# Altium schematic sheet OPA4377.SchDoc
size A4
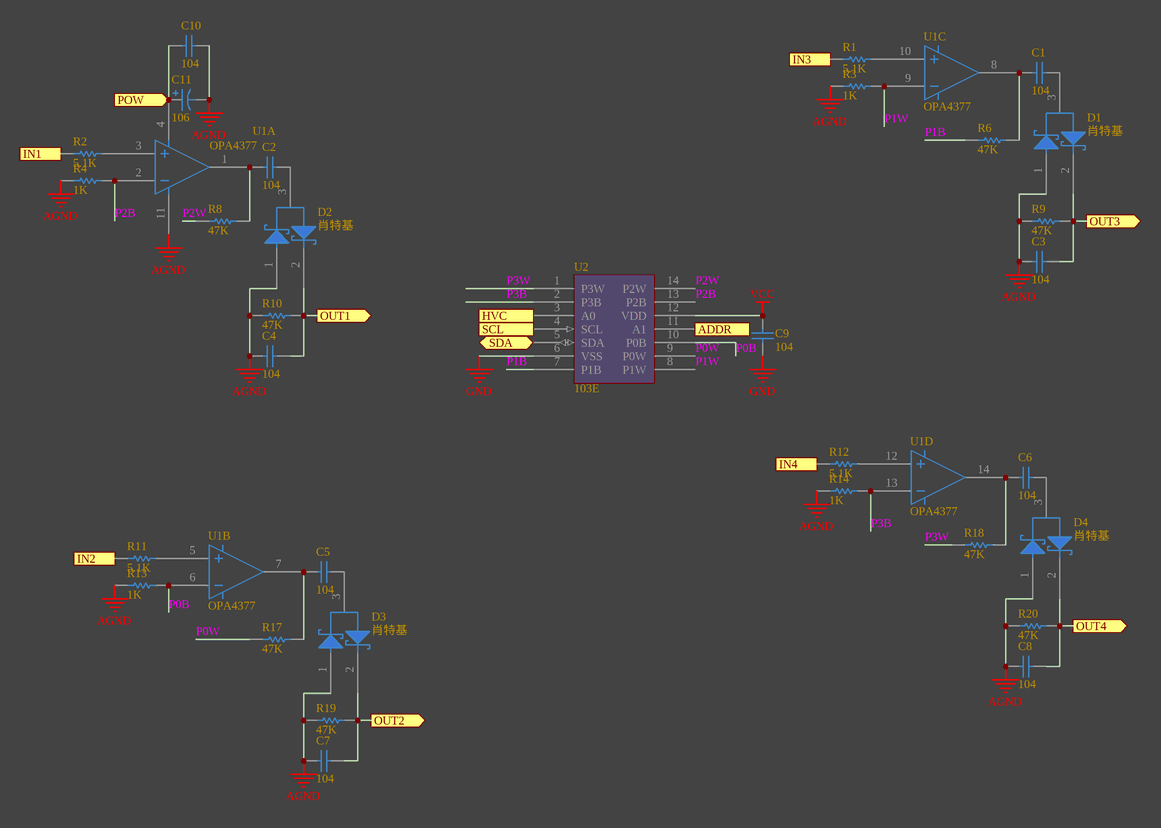
[diagram p0: OPA4377.SchDoc]

## Parts
C1  104  [C0402]
C2  104  [C0402]
C3  104  [C0402]
C4  104  [C0402]
C5  104  [C0402]
C6  104  [C0402]
C7  104  [C0402]
C8  104  [C0402]
C9  104  [C0402]
C10  104  [C0402]
C11  106  [3216-ce]
D1  肖特基  [SOT-23]
D2  肖特基  [SOT-23]
D3  肖特基  [SOT-23]
D4  肖特基  [SOT-23]
R1  5.1K  [R0402]
R2  5.1K  [R0402]
R3  1K  [R0402]
R4  1K  [R0402]
R6  47K  [R0402]
R8  47K  [R0402]
R9  47K  [R0402]
R10  47K  [R0402]
R11  5.1K  [R0402]
R12  5.1K  [R0402]
R13  1K  [R0402]
R14  1K  [R0402]
R17  47K  [R0402]
R18  47K  [R0402]
R19  47K  [R0402]
R20  47K  [R0402]
U1  OPA4377  [TSSOP-14]  (parts A,B,C,D of 4)
U2  103E  [TSSOP-14]

## Ports
ADDR (in), HVC (in), IN1 (in), IN2 (in), IN3 (in), IN4 (in), OUT1 (out), OUT2 (out), OUT3 (out), OUT4 (out), POW (in), SCL (in), SDA (bidir)

## Nets
AGND: C3.1 C4.1 C7.1 C8.1 C10.2 C11.2 D1.1 D2.1 D3.1 D4.1 R3.2 R4.2 R9.2 R10.2 R13.2 R14.2 R19.2 R20.2 U1.11
GND: C9.1 U2.6(VSS)
VCC: C9.2 U2.12(VDD)
ADDR: U2.11(A1) ; port ADDR
HVC: U2.3(A0) ; port HVC
IN1: R2.2 ; port IN1
IN2: R11.2 ; port IN2
IN3: R1.2 ; port IN3
IN4: R12.2 ; port IN4
OUT1: C4.2 D2.2 R10.1 ; port OUT1
OUT2: C7.2 D3.2 R19.1 ; port OUT2
OUT3: C3.2 D1.2 R9.1 ; port OUT3
OUT4: C8.2 D4.2 R20.1 ; port OUT4
P0B: R13.1 U1.6 U2.10(P0B)
P0W: R17.2 U2.9(P0W)
P1B: R6.2 U2.7(P1B)
P1W: R3.1 U1.9 U2.8(P1W)
P2B: R4.1 U1.2 U2.13(P2B)
P2W: R8.2 U2.14(P2W)
P3B: R14.1 U1.13 U2.2(P3B)
P3W: R18.2 U2.1(P3W)
POW: C10.1 C11.1 U1.4 ; port POW
SCL: U2.4(SCL) ; port SCL
SDA: U2.5(SDA) ; port SDA
NetC1_1: C1.1 R6.1 U1.8
NetC1_2: C1.2 D1.3
NetC2_1: C2.1 R8.1 U1.1
NetC2_2: C2.2 D2.3
NetC5_1: C5.1 R17.1 U1.7
NetC5_2: C5.2 D3.3
NetC6_1: C6.1 R18.1 U1.14
NetC6_2: C6.2 D4.3
NetR1_1: R1.1 U1.10
NetR2_1: R2.1 U1.3
NetR11_1: R11.1 U1.5
NetR12_1: R12.1 U1.12

## Library data of the parts
C1-C10 = 电容: Capacitor; Value: 22pF; Published: 8-Jun-2000; LatestRevisionDate: 17-Jul-2002; LatestRevisionNote: Re-released for DXP Platform.; PackageReference: RAD-0.3; Publisher: Altium Limited; PackageDescription: Radial Cap, Thru-Hole; 2 Leads; 0.3 in Pin Spacing
C11 = 电解电容: Polarized Capacitor (Axial); Value: 100pF; Published: 8-Jun-2000; LatestRevisionDate: 17-Jul-2002; LatestRevisionNote: Re-released for DXP Platform.; PackageReference: POLAR0.8; Publisher: Altium Limited; PackageDescription: Polarized Capacitor; 2 Leads
D1-D4 = BAT54S
R1-R4 R6 R8-R14 R17-R20 = 电阻: Resistor; Value: 150R; Published: 8-Jun-2000; LatestRevisionDate: 17-Jul-2002; LatestRevisionNote: Re-released for DXP Platform.; PackageReference: AXIAL-0.3; Publisher: Altium Limited; PackageDescription: Axial Device, Thru-Hole; 2 Leads; 0.3 in Pin Spacing
U1 = 4运放
U2 = MCP4452